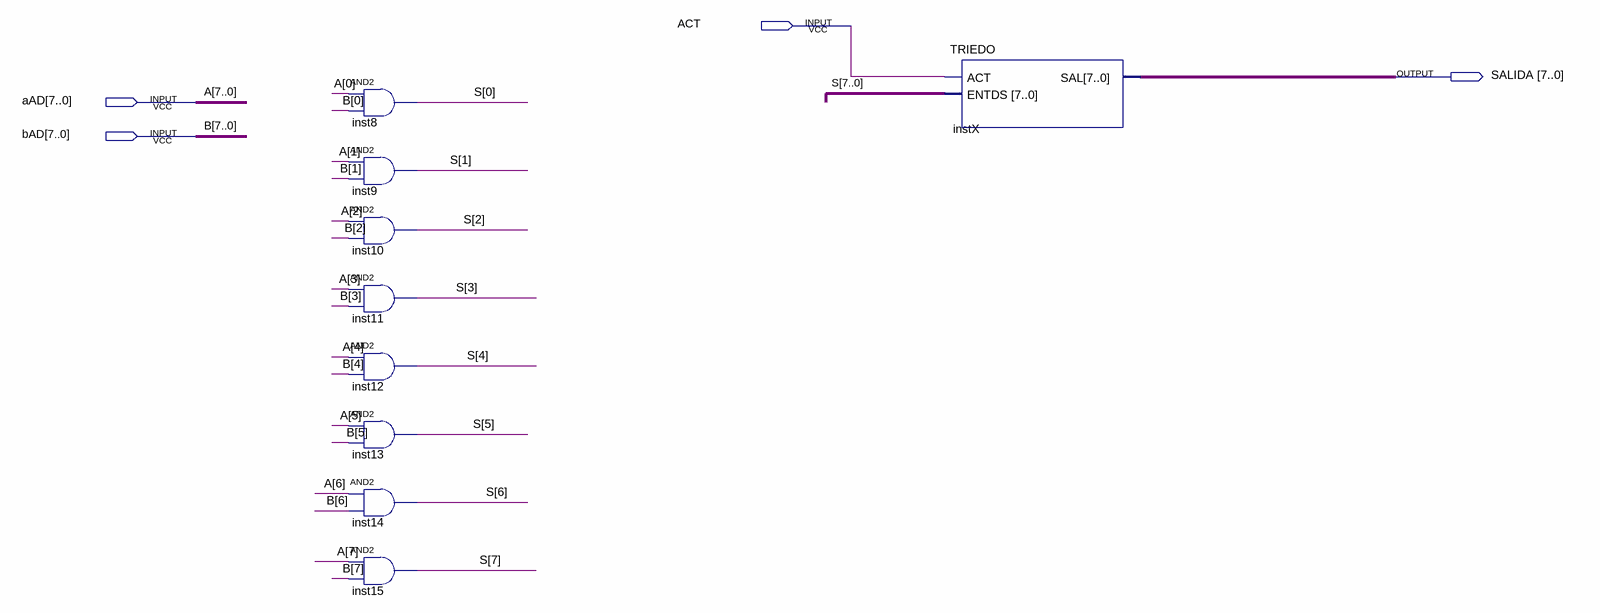
[diagram p0: schematic sheet]
// Quartus schematic F-AND.bdf as structural Verilog: 9 symbols, 4 pins
module \F-AND  (
  input  ACT,
  input  [7:0] aAD,
  input  [7:0] bAD,
  output [7:0] SALIDA
);

  wire [7:0] S;

  and inst8 (S[0], aAD[0], bAD[0]);
  and inst9 (S[1], aAD[1], bAD[1]);
  and inst10 (S[2], aAD[2], bAD[2]);
  and inst11 (S[3], aAD[3], bAD[3]);
  and inst12 (S[4], aAD[4], bAD[4]);
  and inst13 (S[5], aAD[5], bAD[5]);
  and inst14 (S[6], aAD[6], bAD[6]);
  and inst15 (S[7], aAD[7], bAD[7]);
  TRIEDO instX (.ACT(ACT), .ENTDS(S), .SAL(SALIDA));

  // Other names for the same wires on the sheet: A[7:0] = aAD; B[7:0] = bAD
endmodule
